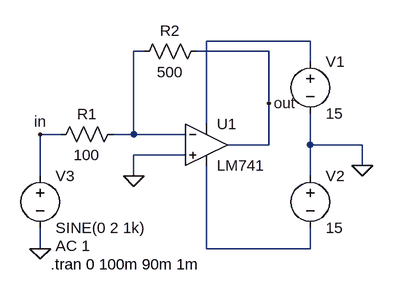
[diagram p0: schematic 7-inv.asc]
7-inv.asc, the LTspice schematic file:
Version 4.1
SHEET 1 880 680
WIRE 384 0 224 0
WIRE 128 16 112 16
WIRE 320 16 208 16
WIRE 384 32 384 0
WIRE 320 96 320 16
WIRE 224 128 224 0
WIRE 0 144 -32 144
WIRE 112 144 112 16
WIRE 112 144 80 144
WIRE 192 144 112 144
WIRE 320 160 320 96
WIRE 320 160 256 160
WIRE 384 160 384 112
WIRE 464 160 384 160
WIRE 192 176 112 176
WIRE 464 192 464 160
WIRE -32 208 -32 144
WIRE 112 208 112 176
WIRE 384 208 384 160
WIRE -32 320 -32 288
WIRE 224 320 224 192
WIRE 384 320 384 288
WIRE 384 320 224 320
FLAG 112 208 0
FLAG -32 320 0
FLAG -32 144 in
FLAG 320 96 out
FLAG 464 192 0
SYMBOL LM741 224 96 R0
SYMATTR InstName U1
SYMBOL voltage 384 16 R0
SYMATTR InstName V1
SYMATTR Value 15
SYMBOL voltage 384 192 R0
SYMATTR InstName V2
SYMATTR Value 15
SYMBOL res 96 128 R90
WINDOW 0 0 56 VBottom 2
WINDOW 3 32 56 VTop 2
SYMATTR InstName R1
SYMATTR Value 100
SYMBOL res 224 0 R90
WINDOW 0 0 56 VBottom 2
WINDOW 3 32 56 VTop 2
SYMATTR InstName R2
SYMATTR Value 500
SYMBOL voltage -32 192 R0
WINDOW 123 24 124 Left 2
WINDOW 39 0 0 Left 0
SYMATTR Value2 AC 1
SYMATTR InstName V3
SYMATTR Value SINE(0 2 1k)
TEXT -16 344 Left 2 !.tran 0 100m 90m 1m

The netlist it stands for:
* 7-inv.asc
X§U1 0 N002 N001 N003 out LM741  ; pins In+ In- V+ V- OUT
V1 N001 0 15
V2 0 N003 15
R1 N002 in 100
R2 out N002 500
V3 in 0 SINE(0 2 1k) AC 1
.tran 0 100m 90m 1m
.lib LM741.lib
.backanno
.end